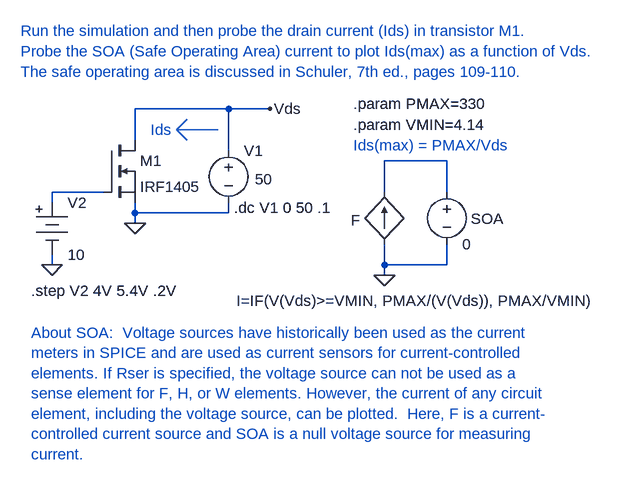
[diagram p0: schematic nmos.asc]
nmos.asc, the LTspice schematic file:
Version 4
SHEET 1 2568 680
WIRE 592 -80 448 -80
WIRE 656 -80 592 -80
WIRE 448 -32 448 -80
WIRE 592 -16 592 -80
WIRE 928 0 832 0
WIRE 400 48 320 48
WIRE 832 48 832 0
WIRE 928 48 928 0
WIRE 320 64 320 48
WIRE 448 80 448 64
WIRE 592 80 592 64
WIRE 592 80 448 80
WIRE 448 96 448 80
WIRE 320 160 320 144
WIRE 832 160 832 128
WIRE 928 160 928 128
WIRE 928 160 832 160
WIRE 832 176 832 160
FLAG 448 96 0
FLAG 320 160 0
FLAG 656 -80 Vds
FLAG 832 176 0
SYMBOL voltage 592 -32 R0
WINDOW 3 41 60 Left 0
WINDOW 123 0 0 Left 0
WINDOW 39 0 0 Left 0
SYMATTR Value 50
SYMATTR InstName V1
SYMBOL nmos 400 -32 R0
SYMATTR InstName M1
SYMATTR Value IRF1405
SYMBOL Misc\\battery 320 48 R0
WINDOW 123 0 0 Left 0
WINDOW 39 0 0 Left 0
SYMATTR InstName V2
SYMATTR Value 10
SYMBOL bi2 832 48 R0
WINDOW 3 -228 167 Left 0
WINDOW 0 -52 43 Left 0
SYMATTR Value I=IF(V(Vds)>=VMIN, PMAX/(V(Vds)), PMAX/VMIN)
SYMATTR InstName F
SYMBOL voltage 928 32 R0
WINDOW 123 0 0 Left 0
WINDOW 39 0 0 Left 0
WINDOW 0 37 57 Left 0
SYMATTR InstName SOA
SYMATTR Value 0
TEXT 600 72 Left 0 !.dc V1 0 50 .1
TEXT 288 200 Left 0 !.step V2 4V 5.4V .2V
TEXT 272 -200 Left 0 ;Run the simulation and then probe the drain current (Ids) in transistor M1.\nProbe the SOA (Safe Operating Area) current to plot Ids(max) as a function of Vds.\nThe safe operating area is discussed in Schuler, 7th ed., pages 109-110.
TEXT 784 -88 Left 0 !.param PMAX=330
TEXT 784 -56 Left 0 !.param VMIN=4.14
TEXT 472 -48 Left 0 ;Ids
TEXT 784 -24 Left 0 ;Ids(max) = PMAX/Vds
TEXT 288 264 Left 0 ;About SOA:  Voltage sources have historically been used as the current \nmeters in SPICE and are used as current sensors for current-controlled \nelements. If Rser is specified, the voltage source can not be used as a \nsense element for F, H, or W elements. However, the current of any circuit \nelement, including the voltage source, can be plotted.  Here, F is a current-\ncontrolled current source and SOA is a null voltage source for measuring\ncurrent.
LINE Normal 512 -48 576 -48
LINE Normal 528 -32 512 -48
LINE Normal 528 -64 512 -48

The netlist it stands for:
* nmos.asc
V1 Vds 0 50
M1 Vds N002 0 0 IRF1405
V2 N002 0 10
B§F 0 N001 I=IF(V(Vds)>=VMIN, PMAX/(V(Vds)), PMAX/VMIN)
V§SOA N001 0 0
.model NMOS NMOS
.model PMOS PMOS
.lib standard.mos
.dc V1 0 50 .1
.step V2 4V 5.4V .2V
* Run the simulation and then probe the drain current (Ids) in transistor M1.
* Probe the SOA (Safe Operating Area) current to plot Ids(max) as a function of Vds.
* The safe operating area is discussed in Schuler, 7th ed., pages 109-110.
.param PMAX=330
.param VMIN=4.14
* Ids
* Ids(max) = PMAX/Vds
* About SOA:  Voltage sources have historically been used as the current
* meters in SPICE and are used as current sensors for current-controlled
* elements. If Rser is specified, the voltage source can not be used as a
* sense element for F, H, or W elements. However, the current of any circuit
* element, including the voltage source, can be plotted.  Here, F is a current-
* controlled current source and SOA is a null voltage source for measuring
* current.
.backanno
.end